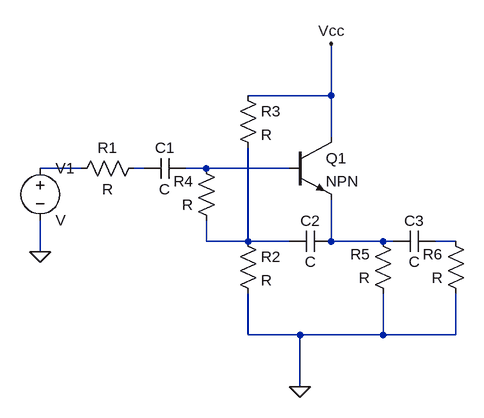
[diagram p0: schematic Draft1.asc]
Draft1.asc, the LTspice schematic file:
Version 4
SHEET 1 880 680
WIRE 368 0 368 -80
WIRE 368 0 240 0
WIRE 368 64 368 0
WIRE -16 112 -80 112
WIRE 80 112 64 112
WIRE 176 112 144 112
WIRE 304 112 176 112
WIRE 176 224 176 192
WIRE 240 224 240 80
WIRE 240 224 176 224
WIRE 304 224 240 224
WIRE 368 224 368 160
WIRE 448 224 368 224
WIRE 464 224 448 224
WIRE 560 224 528 224
WIRE -80 240 -80 192
WIRE 240 368 240 304
WIRE 320 368 240 368
WIRE 448 368 448 304
WIRE 448 368 320 368
WIRE 560 368 560 304
WIRE 560 368 448 368
WIRE 320 448 320 368
FLAG 368 -80 Vcc
FLAG 320 448 0
FLAG -80 240 0
SYMBOL res 80 96 R90
WINDOW 0 0 56 VBottom 2
WINDOW 3 32 56 VTop 2
SYMATTR InstName R1
SYMBOL cap 144 96 R90
WINDOW 0 0 32 VBottom 2
WINDOW 3 32 32 VTop 2
SYMATTR InstName C1
SYMBOL res 224 208 R0
SYMATTR InstName R2
SYMBOL res 224 -16 R0
SYMATTR InstName R3
SYMBOL res 192 208 R180
WINDOW 0 36 76 Left 2
WINDOW 3 36 40 Left 2
SYMATTR InstName R4
SYMBOL res 464 320 R180
WINDOW 0 36 76 Left 2
WINDOW 3 36 40 Left 2
SYMATTR InstName R5
SYMBOL res 576 320 R180
WINDOW 0 36 76 Left 2
WINDOW 3 36 40 Left 2
SYMATTR InstName R6
SYMBOL voltage -80 96 R0
SYMATTR InstName V1
SYMBOL npn 304 64 R0
SYMATTR InstName Q1
SYMBOL cap 368 208 R90
WINDOW 0 0 32 VBottom 2
WINDOW 3 32 32 VTop 2
SYMATTR InstName C2
SYMBOL cap 528 208 R90
WINDOW 0 0 32 VBottom 2
WINDOW 3 32 32 VTop 2
SYMATTR InstName C3

The netlist it stands for:
* Draft1.asc
R1 N002 N001 R
C1 N003 N002 C
R2 N004 0 R
R3 Vcc N004 R
R4 N004 N003 R
R5 0 N005 R
R6 0 N006 R
V1 N001 0 V
Q1 Vcc N003 N005 0 NPN
C2 N005 N004 C
C3 N006 N005 C
.model NPN NPN
.model PNP PNP
.lib standard.bjt
.backanno
.end